# EAGLE design power-board (EAGLE 9.7.0)
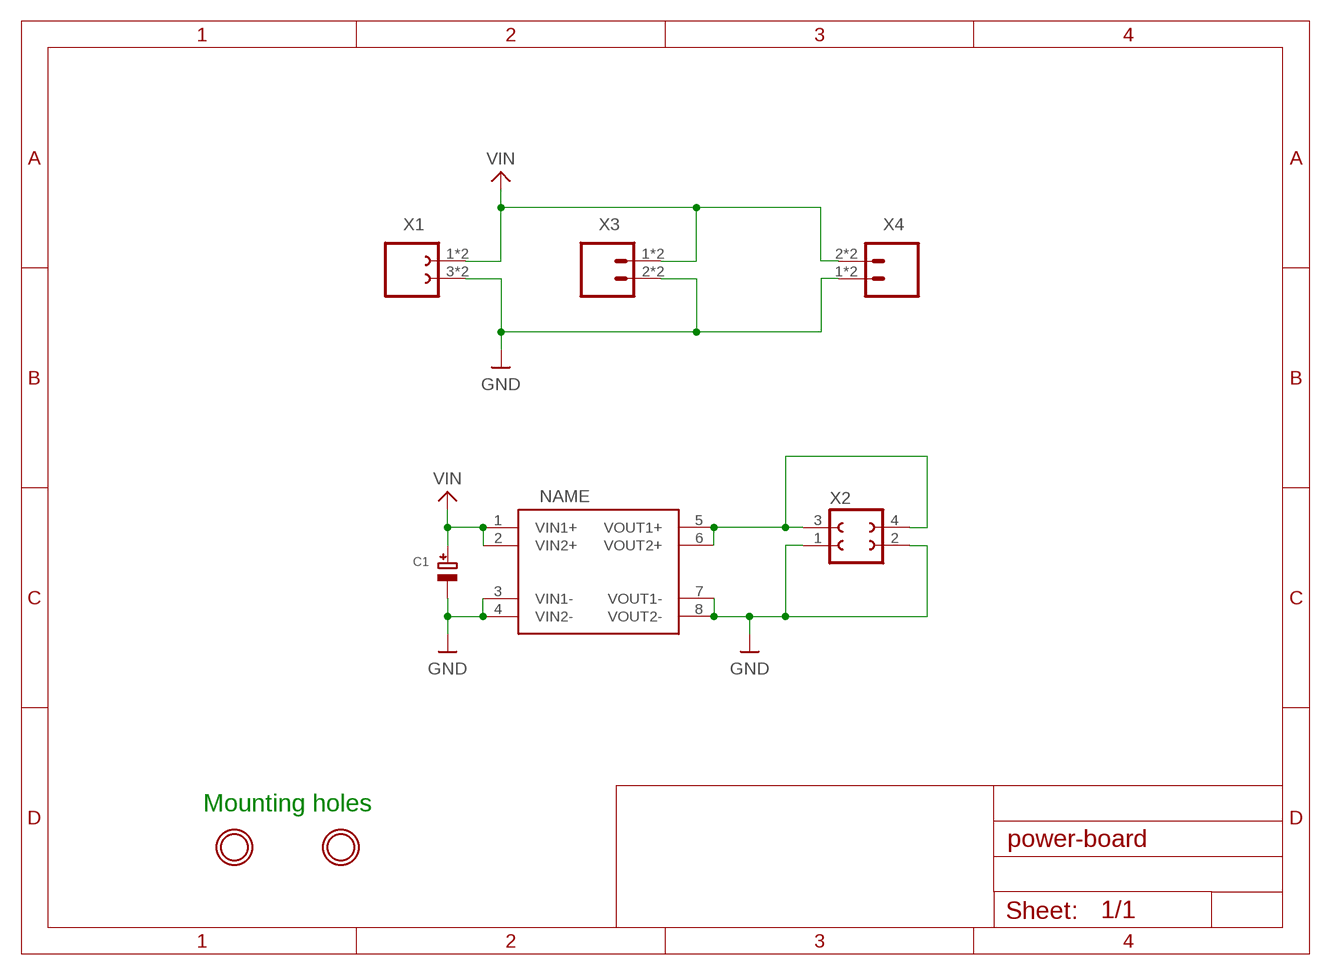
[diagram p0: schematic, sheet 1]

## Parts
C1  CAP_ELECTROLYTIC  [CAPPRD350W60D800H800B]
PS1  K8801MODULE  [K8801]
U$2  MOUNTINGHOLE2.7_THICK  [MOUNTINGHOLE_2.7_PLATED_THICK]
U$3  MOUNTINGHOLE2.7_THICK  [MOUNTINGHOLE_2.7_PLATED_THICK]
X1  CON-FE02-1  [PTSM0,5/2-2,5-HTHRR24]
X2  CON-FE02-2HDRVR4W64P254_2X2  [HDRVR4W64P254_2X2]
X3  CON-MA02-1  [AVX-BTB-009159002001106]
X4  CON-MA02-1  [AVX-BTB-009159002001106]

## Nets
GND: C1.2(-) PS1.3(VIN1-) PS1.4(VIN2-) PS1.7(VOUT1-) PS1.8(VOUT2-) X1.3 X1.4 X2.1 X2.2 X3.2 X3.4 X4.1 X4.3
N$1: PS1.5(VOUT1+) PS1.6(VOUT2+) X2.3 X2.4
VIN: C1.1(+) PS1.1(VIN1+) PS1.2(VIN2+) X1.1 X1.2 X3.1 X3.3 X4.2 X4.4

## Notes on the sheet
- Mounting holes

## Library data of the parts
C1 = _Library.b1f76137-4d0f-4ce2-9703-0cd83550450f.flbr:CAP_ELECTROLYTIC
PS1 = _Library.b1f76137-4d0f-4ce2-9703-0cd83550450f.flbr:K8801: 7V-28V to 5V DC-DC Step Down Power Supply Module Voltage Buck Converter 3A Power Supply Board Input voltage:DC 7V-28V Output valtage:DC 5V Output current:3A. max(2A for long time) Working frequency:570KHz Size:22*17.8*5mm
U$2 U$3 = _Library.b1f76137-4d0f-4ce2-9703-0cd83550450f.flbr:MOUNTINGHOLE: Mounting Hole For #2 screws (0.086"/2.18mm width, 0.094"/2.4mm hole) use 2.5mm; BOM: EXCLUDE
X1 = _Library.b1f76137-4d0f-4ce2-9703-0cd83550450f.flbr:CON-FE02-1
X2 = _Library.b1f76137-4d0f-4ce2-9703-0cd83550450f.flbr:CON-FE02-2
X3 X4 = _Library.b1f76137-4d0f-4ce2-9703-0cd83550450f.flbr:CON-MA02-1

## Board
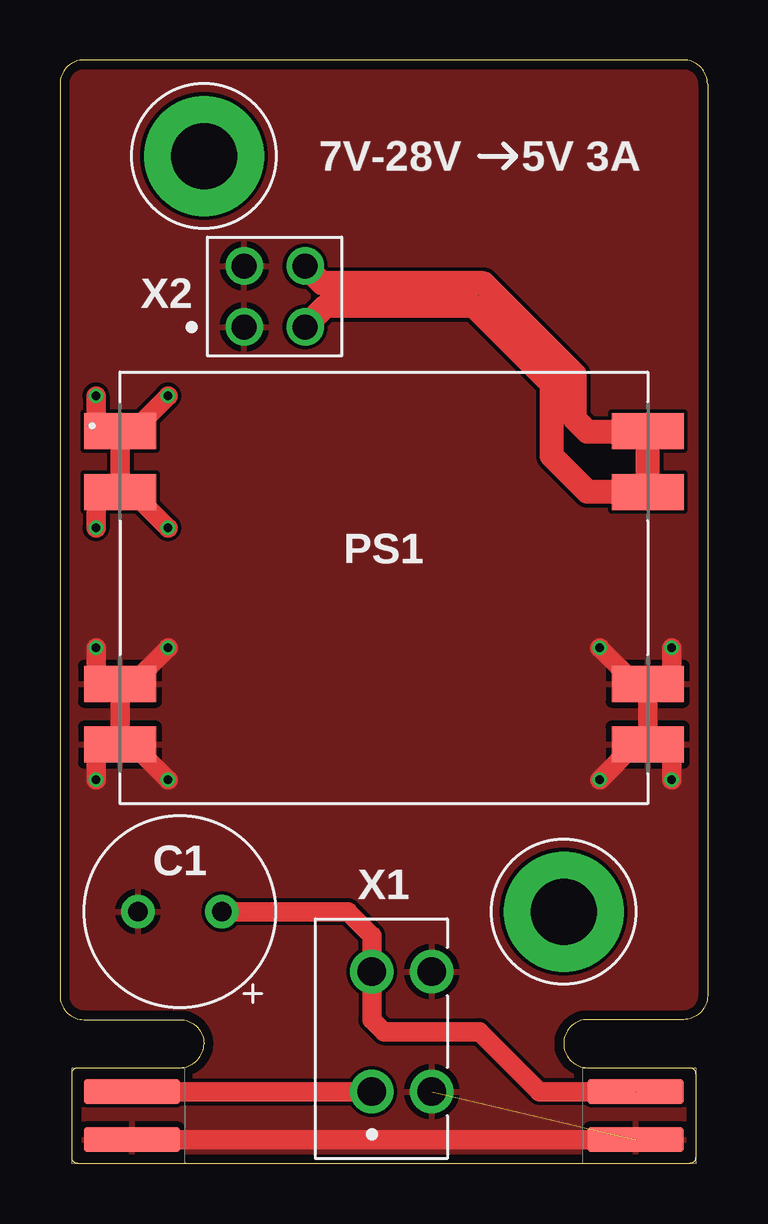
[diagram p1: board, top side]
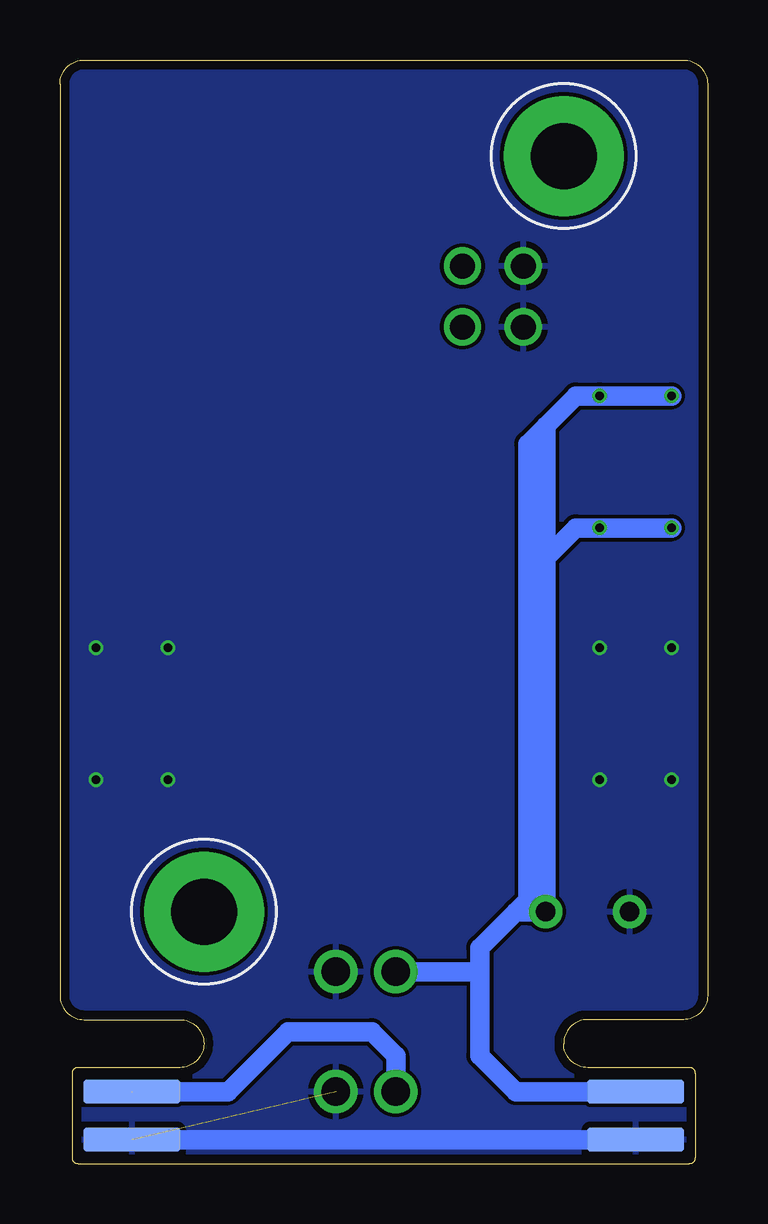
[diagram p2: board, bottom side, seen from below]

Size 27 x 46 mm. Coordinates in mm from the lower left corner, seen from the top.
Outline: 27,45 27,7 arc-90 26,6 22,6 arc90 21,5 arc90 22,4 26.25,4 arc-90 26.5,3.75 26.5,0.25 arc-90 26.25,0 0.75,0 arc-90 0.5,0.25 0.5,3.75 arc-90 0.75,4 5,4 arc90 6,5 arc90 5,6 1,6 arc-90 0,7 0,45 arc-90 1,46 26,46 arc-90 27,45
Copper layers (1*16): Top 0.035559375mm / dielectric 1.6mm / Bottom 0.035559375mm
Design rules "oshpark-2layer *": minimum track width 6mil, minimum drill 10mil, track to track 6mil, track to pad 6mil, pad to pad 6mil, via to via 6mil, smd to smd 6mil, copper to edge 15mil, drill to drill 6mil, minimum pad ring 5mil, minimum via ring 5mil, stop-mask expansion 2.5mil, vias tented up to drill 15mil, thermal gap 10mil

### Footprints (pad centres in the part's own frame; a part is rotated, then mirrored left to right if it is on the bottom)
CAPPRD350W60D800H800B = drill 0.8 pad 1.4: 1 -1.75,0; 2 1.75,0
K8801 = smd 1.5 x 3: 1 -6.54,-11; 2 -4,-11; 3 4,-11; 4 6.54,-11; 5 -6.54,11; 6 -4,11; 7 4,11; 8 6.54,11
MOUNTINGHOLE_2.7_PLATED_THICK = drill 2.75 pad 5: P$1 0,0
PTSM0,5/2-2,5-HTHRR24 = drill 1.2: 1 0,0; 2 0,5; 3 2.5,0; 4 2.5,5
HDRVR4W64P254_2X2 = drill 1.04: 1 0,0; 2 0,2.54; 3 2.54,0; 4 2.54,2.54
AVX-BTB-009159002001106 = smd 4 x 1: 1 0,1; 2 0,-1 | smd 4 x 1 bottom: 3 0,1; 4 0,-1

### Placement (x,y rotation side)
C1  5,10.5 180 top
PS1  13.5,24 270 top
U$2  21,10.5 0 top
U$3  6,42 0 top
X1  13,3 0 top
X2  7.68,34.87 0 top
X3  3,2 0 top
X4  24,2 180 top

### Tracks (layer width: path | path; a pad name or v marks a point on that pad's centre or on a via)
GND  (via drill 0.35)  (2 unrouted)
  Top 0.813: PS1.4 PS1.3 | v1.5,21.5 1.5,20 PS1.3 | v1.5,16 1.5,17.5 2.46,17.5 PS1.4 | v4.5,16 3.04,17.46 PS1.4 | v4.5,21.5 3,20 PS1.3 | PS1.7 PS1.8 | v25.5,21.5 25.5,20 PS1.7 | v25.5,16 25.5,17.5 24.54,17.5 PS1.8 | v22.5,21.5 24,20 PS1.7 | v22.5,16 23.96,17.46 PS1.8 | X3.2 X4.1
  Bottom 0.813: X3.2 X4.1
  pour Top: -2,-2 29,-2 29,48 -2,48
  pour Bottom: -2,-2 29,-2 29,48 -2,48
N$1
  Top 1.01: X2.4 10.94,36.7 17.66,36.7 21.46,32.89 21.46,31.04 22,30.5 24.46,30.5 PS1.5 PS1.6 22,28 20.5,29.5 20.5,32.5 17.27,35.73 11.08,35.73 X2.3
VIN  (via drill 0.35)  (1 unrouted)
  Top 0.813: X3.3 X1.1 | C1.1 12,10.5 13,9.5 X1.2 13,6 13.5,5.5 17.49,5.5 19.99,2.99 X4.2 | PS1.1 PS1.2 | PS1.2 3,28 v4.5,26.5 | v1.5,32 1.5,30.5 3,30.5 v4.5,32 | PS1.2 1.5,28 v1.5,26.5
  Bottom 0.813: X1.1 13,4.5 14,5.5 17.5,5.5 20,3 X4.2 | C1.1 8,10.5 | 8,10.5 9.5,9 9.5,8 | 9.5,8 9.5,4.5 8,3 X3.3 | X1.2 9.5,8 | C1.1 6.75,11.75 | 6.75,11.75 6.75,25.25 | 6.75,25.25 5.5,26.5 v1.5,26.5 | 6.75,25.25 6.75,30.75 | 6.75,30.75 5.5,32 v4.5,32 v1.5,32 | C1.1 7.5,10.5 7.5,30 6.75,30.75 | 6.75,11.75 8,10.5
(copper drawn outside any net)
  shapes: Bottom area x2, Top area x7

### Text on the board
tNames: 7V-28V 5V 3A